# EAGLE design 3xAttenuators (EAGLE 9.6.2)
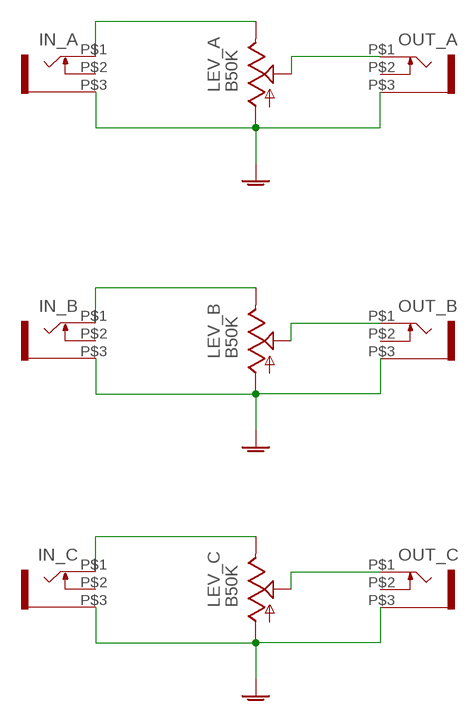
[diagram p0: schematic, sheet 1]

## Parts
IN_A  THONKICONN_WQP-PJ301M-12_JACK  [THONKICONN_WQP-PJ301M-12_JACK]
IN_B  THONKICONN_WQP-PJ301M-12_JACK  [THONKICONN_WQP-PJ301M-12_JACK]
IN_C  THONKICONN_WQP-PJ301M-12_JACK  [THONKICONN_WQP-PJ301M-12_JACK]
LEV_A  B50K  MUSICTHINGMODULAR_9MM_SNAP-IN_POT_  [MUSICTHINGMODULAR_9MM_SNAP-IN_POT]
LEV_B  B50K  MUSICTHINGMODULAR_9MM_SNAP-IN_POT_  [MUSICTHINGMODULAR_9MM_SNAP-IN_POT]
LEV_C  B50K  MUSICTHINGMODULAR_9MM_SNAP-IN_POT_  [MUSICTHINGMODULAR_9MM_SNAP-IN_POT]
OUT_A  THONKICONN_WQP-PJ301M-12_JACK  [THONKICONN_WQP-PJ301M-12_JACK]
OUT_B  THONKICONN_WQP-PJ301M-12_JACK  [THONKICONN_WQP-PJ301M-12_JACK]
OUT_C  THONKICONN_WQP-PJ301M-12_JACK  [THONKICONN_WQP-PJ301M-12_JACK]

## Nets
GND: IN_A.P$3 IN_B.P$3 IN_C.P$3 LEV_A.1(A) LEV_B.1(A) LEV_C.1(A) OUT_A.P$3 OUT_B.P$3 OUT_C.P$3 ; supply symbol labelled GNDA
N$1: IN_C.P$1 LEV_C.3(E)
N$2: LEV_A.2(S) OUT_A.P$1
N$3: IN_B.P$1 LEV_B.3(E)
N$4: LEV_B.2(S) OUT_B.P$1
N$5: IN_A.P$1 LEV_A.3(E)
N$6: LEV_C.2(S) OUT_C.P$1
Unconnected: IN_A.P$2 IN_B.P$2 IN_C.P$2 OUT_A.P$2 OUT_B.P$2 OUT_C.P$2

## Library data of the parts
IN_A IN_B IN_C OUT_A OUT_B OUT_C = ES-2144 LPF Module:THONKICONN_WQP-PJ301M-12_JACK
LEV_A LEV_B LEV_C = ES-2144 LPF Module:MUSICTHINGMODULAR_9MM_SNAP-IN_POT: 9mm vertical snap-in pot, Alpha / Panasonic style

## Board
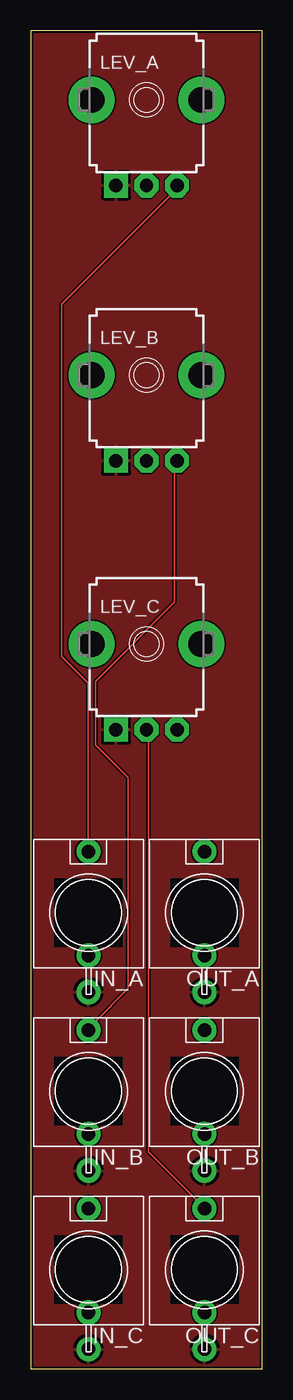
[diagram p1: board, top side]
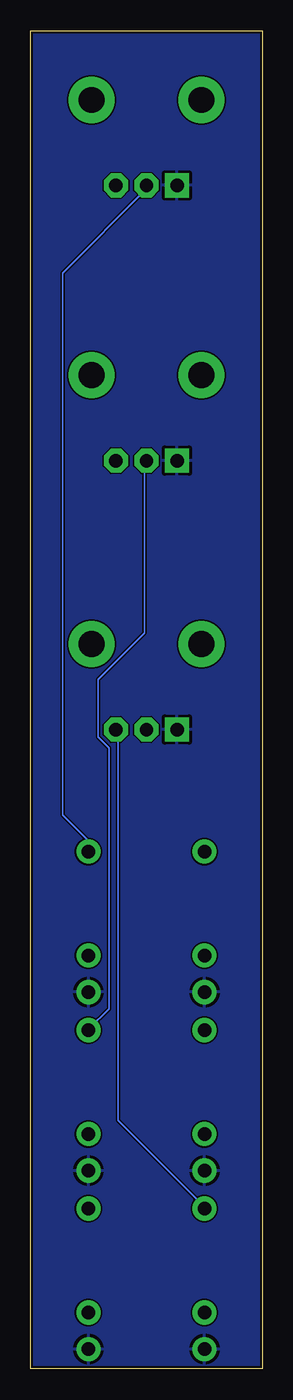
[diagram p2: board, bottom side, seen from below]

Size 19 x 109.5 mm. Coordinates in mm from the lower left corner, seen from the top.
Outline: 0,0 19,0 19,109.5 0,109.5 0,0
Copper layers (1*16): Top 0.035mm / dielectric 1.6mm / Bottom 0.035mm
Design rules "jlcpcb-2layers": minimum track width 5mil, minimum drill 0.3mm, track to track 5mil, track to pad 5mil, pad to pad 5mil, via to via 5mil, smd to smd 5mil, copper to edge 0.2mm, drill to drill 6mil, minimum pad ring 10mil, minimum via ring 3mil, stop-mask expansion 4mil, vias tented up to drill 0mil, thermal gap 10mil

### Footprints (pad centres in the part's own frame; a part is rotated, then mirrored left to right if it is on the bottom)
THONKICONN_WQP-PJ301M-12_JACK = drill 1.1: P$1 0,5; P$2 0,-3.5; P$3 0,-6.5
MUSICTHINGMODULAR_9MM_SNAP-IN_POT = drill 1.1 square: 1 -2.5,-7 | drill 1.1 octagon: 2 0,-7; 3 2.5,-7 | drill 2.1 pad 2.794: CHASSIS1 -4.5,0; CHASSIS2 4.5,0

### Placement (x,y rotation side)
IN_A  4.75,37.33 0 top
IN_B  4.75,22.73 0 top
IN_C  4.75,8.12 0 top
LEV_A  9.5,103.83 0 top
LEV_B  9.5,81.31 0 top
LEV_C  9.5,59.31 0 top
OUT_A  14.25,37.33 0 top
OUT_B  14.25,22.73 0 top
OUT_C  14.25,8.12 0 top

### Tracks (layer width: path | path; a pad name or v marks a point on that pad's centre or on a via)
GND
  pour Top: 19,109.5 0,109.5 0,0 19,0
  pour Bottom: 19,109.5 0,109.5 0,0 19,0
N$1
  Bottom 0.127: IN_C.P$1 4.83,13.21 5.33,13.72 5.33,13.84 11.81,20.32 11.81,52.07 11.94,52.2 LEV_C.3
N$2
  Bottom 0.127: OUT_A.P$1 14.35,42.42 14.35,43.31 16.38,45.34 16.38,89.66 9.53,96.52 9.53,96.77 LEV_A.2
N$3
  Top 0.127: IN_B.P$1 4.83,27.81 5.33,28.32 5.33,28.45 8,31.11 8,48.39 5.33,51.05 5.33,56.26 11.81,62.74 11.81,74.17 11.94,74.3 LEV_B.3
N$4
  Bottom 0.127: OUT_B.P$1 14.22,27.81 12.57,29.46 12.57,50.8 13.46,51.69 13.46,56.39 9.65,60.2 9.65,74.17 9.53,74.3 LEV_B.2
N$5
  Top 0.127: IN_A.P$1 4.7,42.42 4.7,56.13 2.54,58.29 2.54,87.12 11.94,96.52 11.94,96.77 LEV_A.3
N$6
  Top 0.127: OUT_C.P$1 14.22,13.21 9.65,17.78 9.65,52.07 9.53,52.2 LEV_C.2